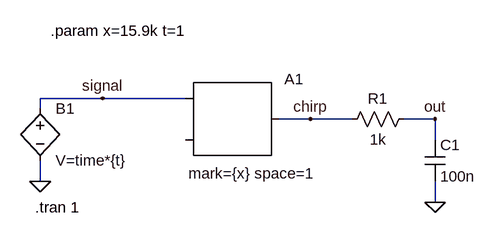
[diagram p0: schematic 04-chirp_rc_lpf.asc]
04-chirp_rc_lpf.asc, the LTspice schematic file:
Version 4
SHEET 1 880 680
WIRE 64 112 -32 112
WIRE 192 112 64 112
WIRE -32 128 -32 112
WIRE 384 144 336 144
WIRE 448 144 384 144
WIRE 576 144 528 144
WIRE 576 176 576 144
WIRE -32 240 -32 208
WIRE 576 272 576 240
FLAG -32 240 0
FLAG 384 144 chirp
FLAG 64 112 signal
FLAG 576 272 0
FLAG 576 144 out
SYMBOL SpecialFunctions\\modulate 192 112 R0
WINDOW 3 4 116 Left 2
SYMATTR InstName A1
SYMATTR Value mark={x} space=1
SYMBOL bv -32 112 R0
SYMATTR InstName B1
SYMATTR Value V=time*{t}
SYMBOL res 544 128 R90
WINDOW 0 0 56 VBottom 2
WINDOW 3 32 56 VTop 2
SYMATTR InstName R1
SYMATTR Value 1k
SYMBOL cap 560 176 R0
SYMATTR InstName C1
SYMATTR Value 100n
TEXT -40 280 Left 2 !.tran 1
TEXT -16 8 Left 2 !.param x=15.9k t=1

The netlist it stands for:
* 04-chirp_rc_lpf.asc
A1 signal 0 0 0 0 0 chirp 0 MODULATOR mark={x} space=1
B1 signal 0 V=time*{t}
R1 out chirp 1k
C1 out 0 100n
.tran 1
.param x=15.9k t=1
.backanno
.end